# Altium schematic sheet TK510_Mekanisk.SchDoc: TK510 Mekanisk
size A3; Author: Øystein Smith; Organization: Omega Verksted; DocumentNumber: 3; Revision: 0; SheetNumber: 3; SheetTotal: 20
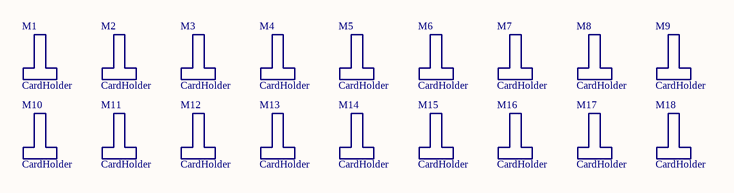
[diagram p0: TK510_Mekanisk.SchDoc]

## Parts
M1  CardHolder  [CardHolder900X1900X84000]
M2  CardHolder  [CardHolder900X1900X84000]
M3  CardHolder  [CardHolder900X1900X84000]
M4  CardHolder  [CardHolder900X1900X84000]
M5  CardHolder  [CardHolder900X1900X84000]
M6  CardHolder  [CardHolder900X1900X84000]
M7  CardHolder  [CardHolder900X1900X84000]
M8  CardHolder  [CardHolder900X1900X84000]
M9  CardHolder  [CardHolder900X1900X84000]
M10  CardHolder  [CardHolder900X1900X84000]
M11  CardHolder  [CardHolder900X1900X84000]
M12  CardHolder  [CardHolder900X1900X84000]
M13  CardHolder  [CardHolder900X1900X84000]
M14  CardHolder  [CardHolder900X1900X84000]
M15  CardHolder  [CardHolder900X1900X84000]
M16  CardHolder  [CardHolder900X1900X84000]
M17  CardHolder  [CardHolder900X1900X84000]
M18  CardHolder  [CardHolder900X1900X84000]

## Notes on the sheet
- Size:
- Date:
- Title:
- A3
- Revision:
- Sheet
- of
- Author:
- File:

## Library data of the parts
M1-M18 = 3242: Støtter kort i bakplan; navn: KortStøtte 84mm; rad: 5; rom: OV; lager_type: Fremlager; dybde: 0; hylle: 6; antall: 20; pakke_opprettet_av: 815; nokkelord: support, cardholder, kortholder; pakketype: TH; id: 3242; pakke_opprettet: 12/07/2014 20:29:43; symbol_opprettet_av: 815; symbol_opprettet: 12/07/2014 20:29:53; pris: 5